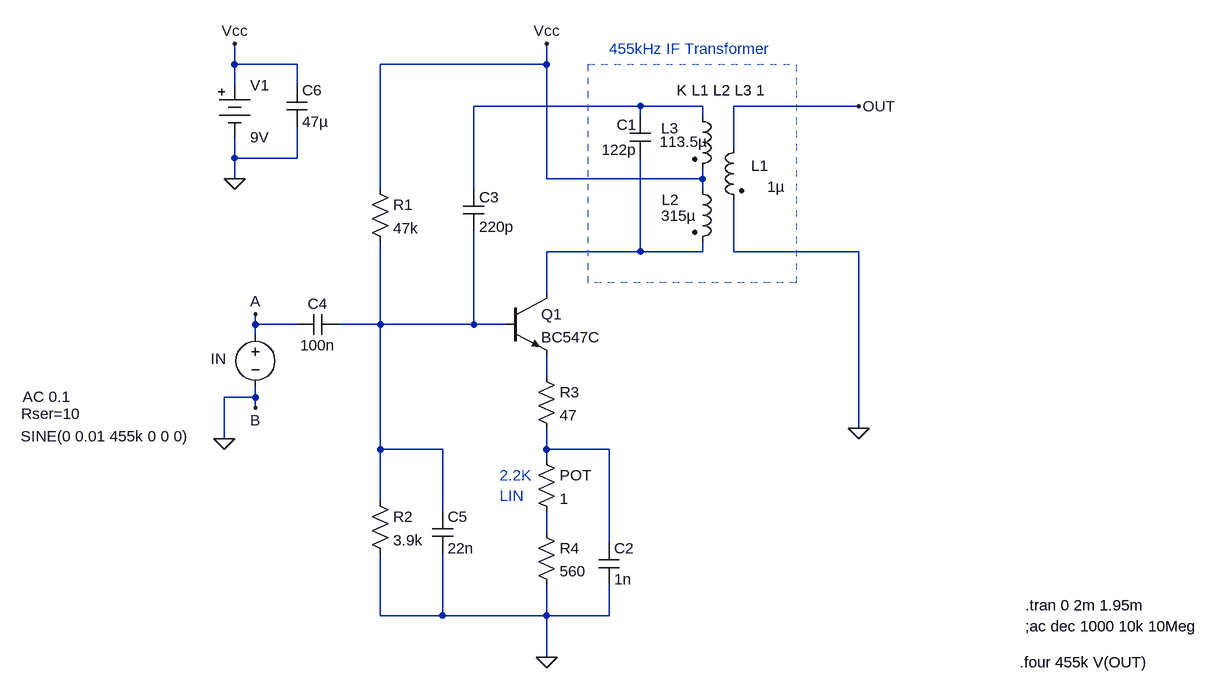
[diagram p0: schematic transistor-IF-stage-capacitive-coupling.asc]
transistor-IF-stage-capacitive-coupling.asc, the LTspice schematic file:
Version 4.1
SHEET 1 956 1052
WIRE -544 0 -544 -32
WIRE -448 0 -544 0
WIRE -64 0 -64 -32
WIRE -64 0 -320 0
WIRE -544 32 -544 0
WIRE -448 32 -448 0
WIRE 80 64 -176 64
WIRE 176 64 80 64
WIRE 416 64 224 64
WIRE 80 80 80 64
WIRE 176 80 176 64
WIRE 224 128 224 64
WIRE -544 144 -544 112
WIRE -448 144 -448 96
WIRE -448 144 -544 144
WIRE -544 176 -544 144
WIRE -64 176 -64 0
WIRE 176 176 176 160
WIRE 176 176 -64 176
WIRE -320 192 -320 0
WIRE -176 192 -176 64
WIRE 176 192 176 176
WIRE 80 288 80 144
WIRE 80 288 -64 288
WIRE 176 288 176 272
WIRE 176 288 80 288
WIRE 224 288 224 208
WIRE 416 288 224 288
WIRE -64 352 -64 288
WIRE -512 400 -512 384
WIRE -448 400 -512 400
WIRE -320 400 -320 272
WIRE -320 400 -384 400
WIRE -176 400 -176 256
WIRE -176 400 -320 400
WIRE -128 400 -176 400
WIRE -512 416 -512 400
WIRE -64 480 -64 448
WIRE -512 512 -512 496
WIRE -512 512 -560 512
WIRE -512 528 -512 512
WIRE 416 560 416 288
WIRE -560 576 -560 512
WIRE -320 592 -320 400
WIRE -224 592 -320 592
WIRE -64 592 -64 560
WIRE 32 592 -64 592
WIRE -64 608 -64 592
WIRE -320 672 -320 592
WIRE -224 688 -224 592
WIRE -64 720 -64 688
WIRE 32 736 32 592
WIRE -320 848 -320 752
WIRE -224 848 -224 752
WIRE -224 848 -320 848
WIRE -64 848 -64 800
WIRE -64 848 -224 848
WIRE 32 848 32 800
WIRE 32 848 -64 848
WIRE -64 912 -64 848
FLAG -64 912 0
FLAG -64 -32 Vcc
FLAG 416 560 0
FLAG -544 -32 Vcc
FLAG -544 176 0
FLAG 416 64 OUT
FLAG -512 384 A
FLAG -512 528 B
FLAG -560 576 0
SYMBOL ind2 240 112 M0
WINDOW 0 -38 44 Left 2
WINDOW 3 -62 76 Left 2
SYMATTR InstName L1
SYMATTR Value 1µ
SYMATTR SpiceLine Rser=0.3
SYMBOL ind2 160 176 R0
WINDOW 0 -47 32 Left 2
WINDOW 3 -48 57 Left 2
SYMATTR InstName L2
SYMATTR Value 315µ
SYMATTR SpiceLine Rser=20
SYMBOL ind2 160 64 R0
WINDOW 0 -48 34 Left 2
WINDOW 3 -50 55 Left 2
SYMATTR InstName L3
SYMATTR Value 113.5µ
SYMATTR SpiceLine Rser=16
SYMBOL cap 64 80 R0
WINDOW 0 -20 13 Left 2
WINDOW 3 -43 51 Left 2
SYMATTR InstName C1
SYMATTR Value 122p
SYMBOL npn -128 352 R0
SYMATTR InstName Q1
SYMATTR Value BC547C
SYMBOL res -80 704 R0
SYMATTR InstName R4
SYMATTR Value 560
SYMBOL cap 16 736 R0
SYMATTR InstName C2
SYMATTR Value 1n
SYMBOL cap -192 192 R0
WINDOW 0 24 12 Left 2
WINDOW 3 24 58 Left 2
SYMATTR InstName C3
SYMATTR Value 220p
SYMBOL res -336 176 R0
SYMATTR InstName R1
SYMATTR Value 47k
SYMBOL res -336 656 R0
SYMATTR InstName R2
SYMATTR Value 3.9k
SYMBOL voltage -512 400 R0
WINDOW 0 -69 53 Left 2
WINDOW 3 -361 172 Left 2
WINDOW 123 -358 111 Left 2
WINDOW 39 -360 137 Left 2
SYMATTR InstName IN
SYMATTR Value SINE(0 0.01 455k 0 0 0)
SYMATTR Value2 AC 0.1
SYMATTR SpiceLine Rser=10
SYMBOL Misc\\battery -544 16 R0
SYMATTR InstName V1
SYMATTR Value 9V
SYMBOL cap -240 688 R0
SYMATTR InstName C5
SYMATTR Value 22n
SYMBOL cap -464 32 R0
SYMATTR InstName C6
SYMATTR Value 47µ
SYMBOL cap -384 384 R90
WINDOW 0 0 32 VBottom 2
WINDOW 3 32 32 VTop 2
SYMATTR InstName C4
SYMATTR Value 100n
SYMBOL res -80 464 R0
SYMATTR InstName R3
SYMATTR Value 47
SYMBOL res -80 592 R0
SYMATTR InstName POT
SYMATTR Value 1
TEXT 136 40 Left 2 !K L1 L2 L3 1
TEXT 672 832 Left 2 !.tran 0 2m 1.95m
TEXT 672 864 Left 2 !;ac dec 1000 10k 10Meg
TEXT 32 -24 Left 2 ;455kHz IF Transformer
TEXT 664 920 Left 2 !.four 455k V(OUT)
TEXT -136 632 Left 2 ;2.2K\nLIN
RECTANGLE Normal 320 336 0 0 2

The netlist it stands for:
* transistor-IF-stage-capacitive-coupling.asc
L1 OUT 0 1µ Rser=0.3
L2 Vcc N002 315µ Rser=20
L3 N001 Vcc 113.5µ Rser=16
C1 N001 N002 122p
Q1 N002 N003 N004 0 BC547C
R4 N006 0 560
C2 N005 0 1n
C3 N001 N003 220p
R1 Vcc N003 47k
R2 N003 0 3.9k
V§IN A 0 SINE(0 0.01 455k 0 0 0) AC 0.1 Rser=10
V1 Vcc 0 9V
C5 N003 0 22n
C6 Vcc 0 47µ
C4 N003 A 100n
R3 N004 N005 47
R§POT N005 N006 1
.model NPN NPN
.model PNP PNP
.lib standard.bjt
K L1 L2 L3 1
.tran 0 2m 1.95m
;ac dec 1000 10k 10Meg
* 455kHz IF Transformer
.four 455k V(OUT)
* 2.2K
* LIN
.backanno
.end